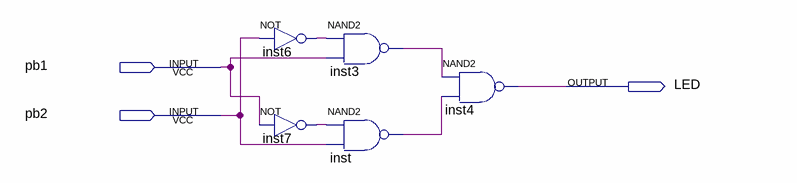
[diagram p0: schematic sheet]
// Quartus schematic FPGA1.bdf as structural Verilog: 5 symbols, 3 pins
module FPGA1 (
  input  pb1,
  input  pb2,
  output LED
);

  wire inst3_out, inst6_out, inst7_out, inst_out;

  not inst6 (inst6_out, pb2);
  not inst7 (inst7_out, pb1);
  nand inst3 (inst3_out, inst6_out, pb1);
  nand inst (inst_out, inst7_out, pb2);
  nand inst4 (LED, inst3_out, inst_out);
endmodule
